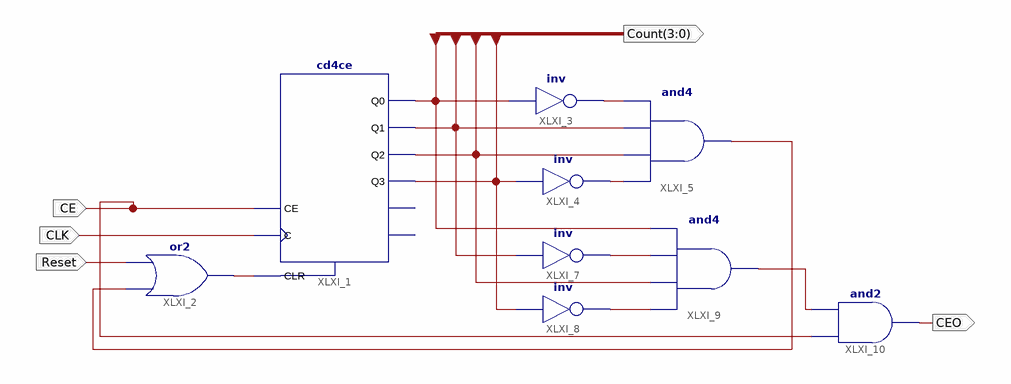
[diagram p0: schematic sheet 1]
// Xilinx ISE schematic Counter0_5.sch (spartan6) as structural Verilog: 9 symbols, 5 ports
module Counter0_5 (
  input  Reset,
  input  CLK,
  input  CE,
  output [3:0] Count,
  output CEO
);

  wire XLXN_1, XLXN_7, XLXN_8, XLXN_17, XLXN_19, XLXN_28, XLXN_29;

  cd4ce XLXI_1 (
    .C(CLK), .CE(CE), .CLR(XLXN_1), .Q0(Count[0]), .Q1(Count[1]), .Q2(Count[2]), .Q3(Count[3]));  // open: CEO, TC
  or XLXI_2 (XLXN_1, XLXN_28, Reset);
  not XLXI_3 (XLXN_8, Count[0]);
  not XLXI_4 (XLXN_7, Count[3]);
  and XLXI_5 (XLXN_28, XLXN_7, Count[2], Count[1], XLXN_8);
  not XLXI_7 (XLXN_17, Count[1]);
  not XLXI_8 (XLXN_19, Count[3]);
  and XLXI_9 (XLXN_29, XLXN_19, Count[2], XLXN_17, Count[0]);
  and XLXI_10 (CEO, CE, XLXN_29);
endmodule
